# Altium schematic sheet current-monitor.SchDoc
size 297 x 209 mm
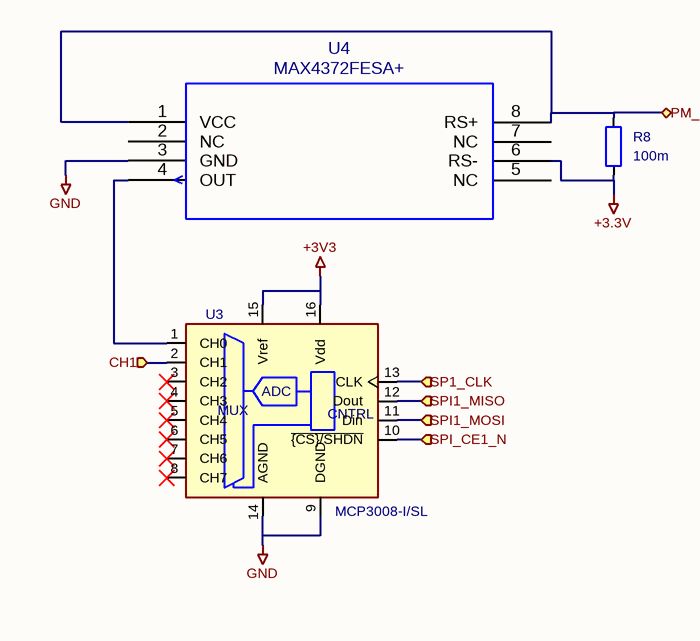
[diagram p0: current-monitor.SchDoc]

## Parts
R8  100m  [R_0402_1005Metric]
U3  MCP3008-I/SL  [Microchip-MCP3008-I_SL-Level_A]
U4  MAX4372FESA+  [Maxim-MAX4372FESA+-Level_A]

## Ports
CH1 (in), PM_Input (bidir), SP1_CLK (in), SPI1_MISO (in), SPI1_MOSI (in), SPI_CE1_N (in)

## Nets
+3.3V: R8.2 U4.6(RS-)
+3V3: U3.15(Vref) U3.16(Vdd)
GND: U3.9(DGND) U3.14(AGND) U4.3(GND)
CH1: U3.2(CH1) ; port CH1
PM_Input: R8.1 U4.1(VCC) U4.8(RS+) ; port PM_Input
SP1_CLK: U3.13(CLK) ; port SP1_CLK
SPI1_MISO: U3.12(Dout) ; port SPI1_MISO
SPI1_MOSI: U3.11(Din) ; port SPI1_MOSI
SPI_CE1_N: U3.10(~{{CS}/SHDN}) ; port SPI_CE1_N
NetU3_1: U3.1(CH0) U4.4(OUT)

Not connected (* = marked no-connect by the designer): U3 3(CH2)* 4(CH3)* 5(CH4)* 6(CH5)* 7(CH6)* 8(CH7)*; U4 2(NC) 5(NC) 7(NC)

## Notes on the sheet
- 1
- 2
- 3
- 4
- 5
- 6
- A
- B
- C
- D
- Title:
- File: current-monitor.kicad_sch
- Sheet: /
- KiCad E.D.A.  kicad (5.1.4)-1
- Size: A4
- Date:
- Rev:
- Id: 1/1
- (in symbol MCP3008) ADC; MUX; CNTRL

## Library data of the parts
R8 = R: Value: 100m; Footprint: Resistor_SMD:R_0402_1005Metric
U3 = MCP3008: Value: MCP3008-I/SL; Footprint: qset-footprints:Microchip-MCP3008-I_SL-Level_A
U4 = MAX4372FESA+-MAX4372FESA+: Value: MAX4372FESA+; Footprint: qset-footprints:Maxim-MAX4372FESA+-Level_A